# EAGLE schematic stm32uni (EAGLE 6.1)
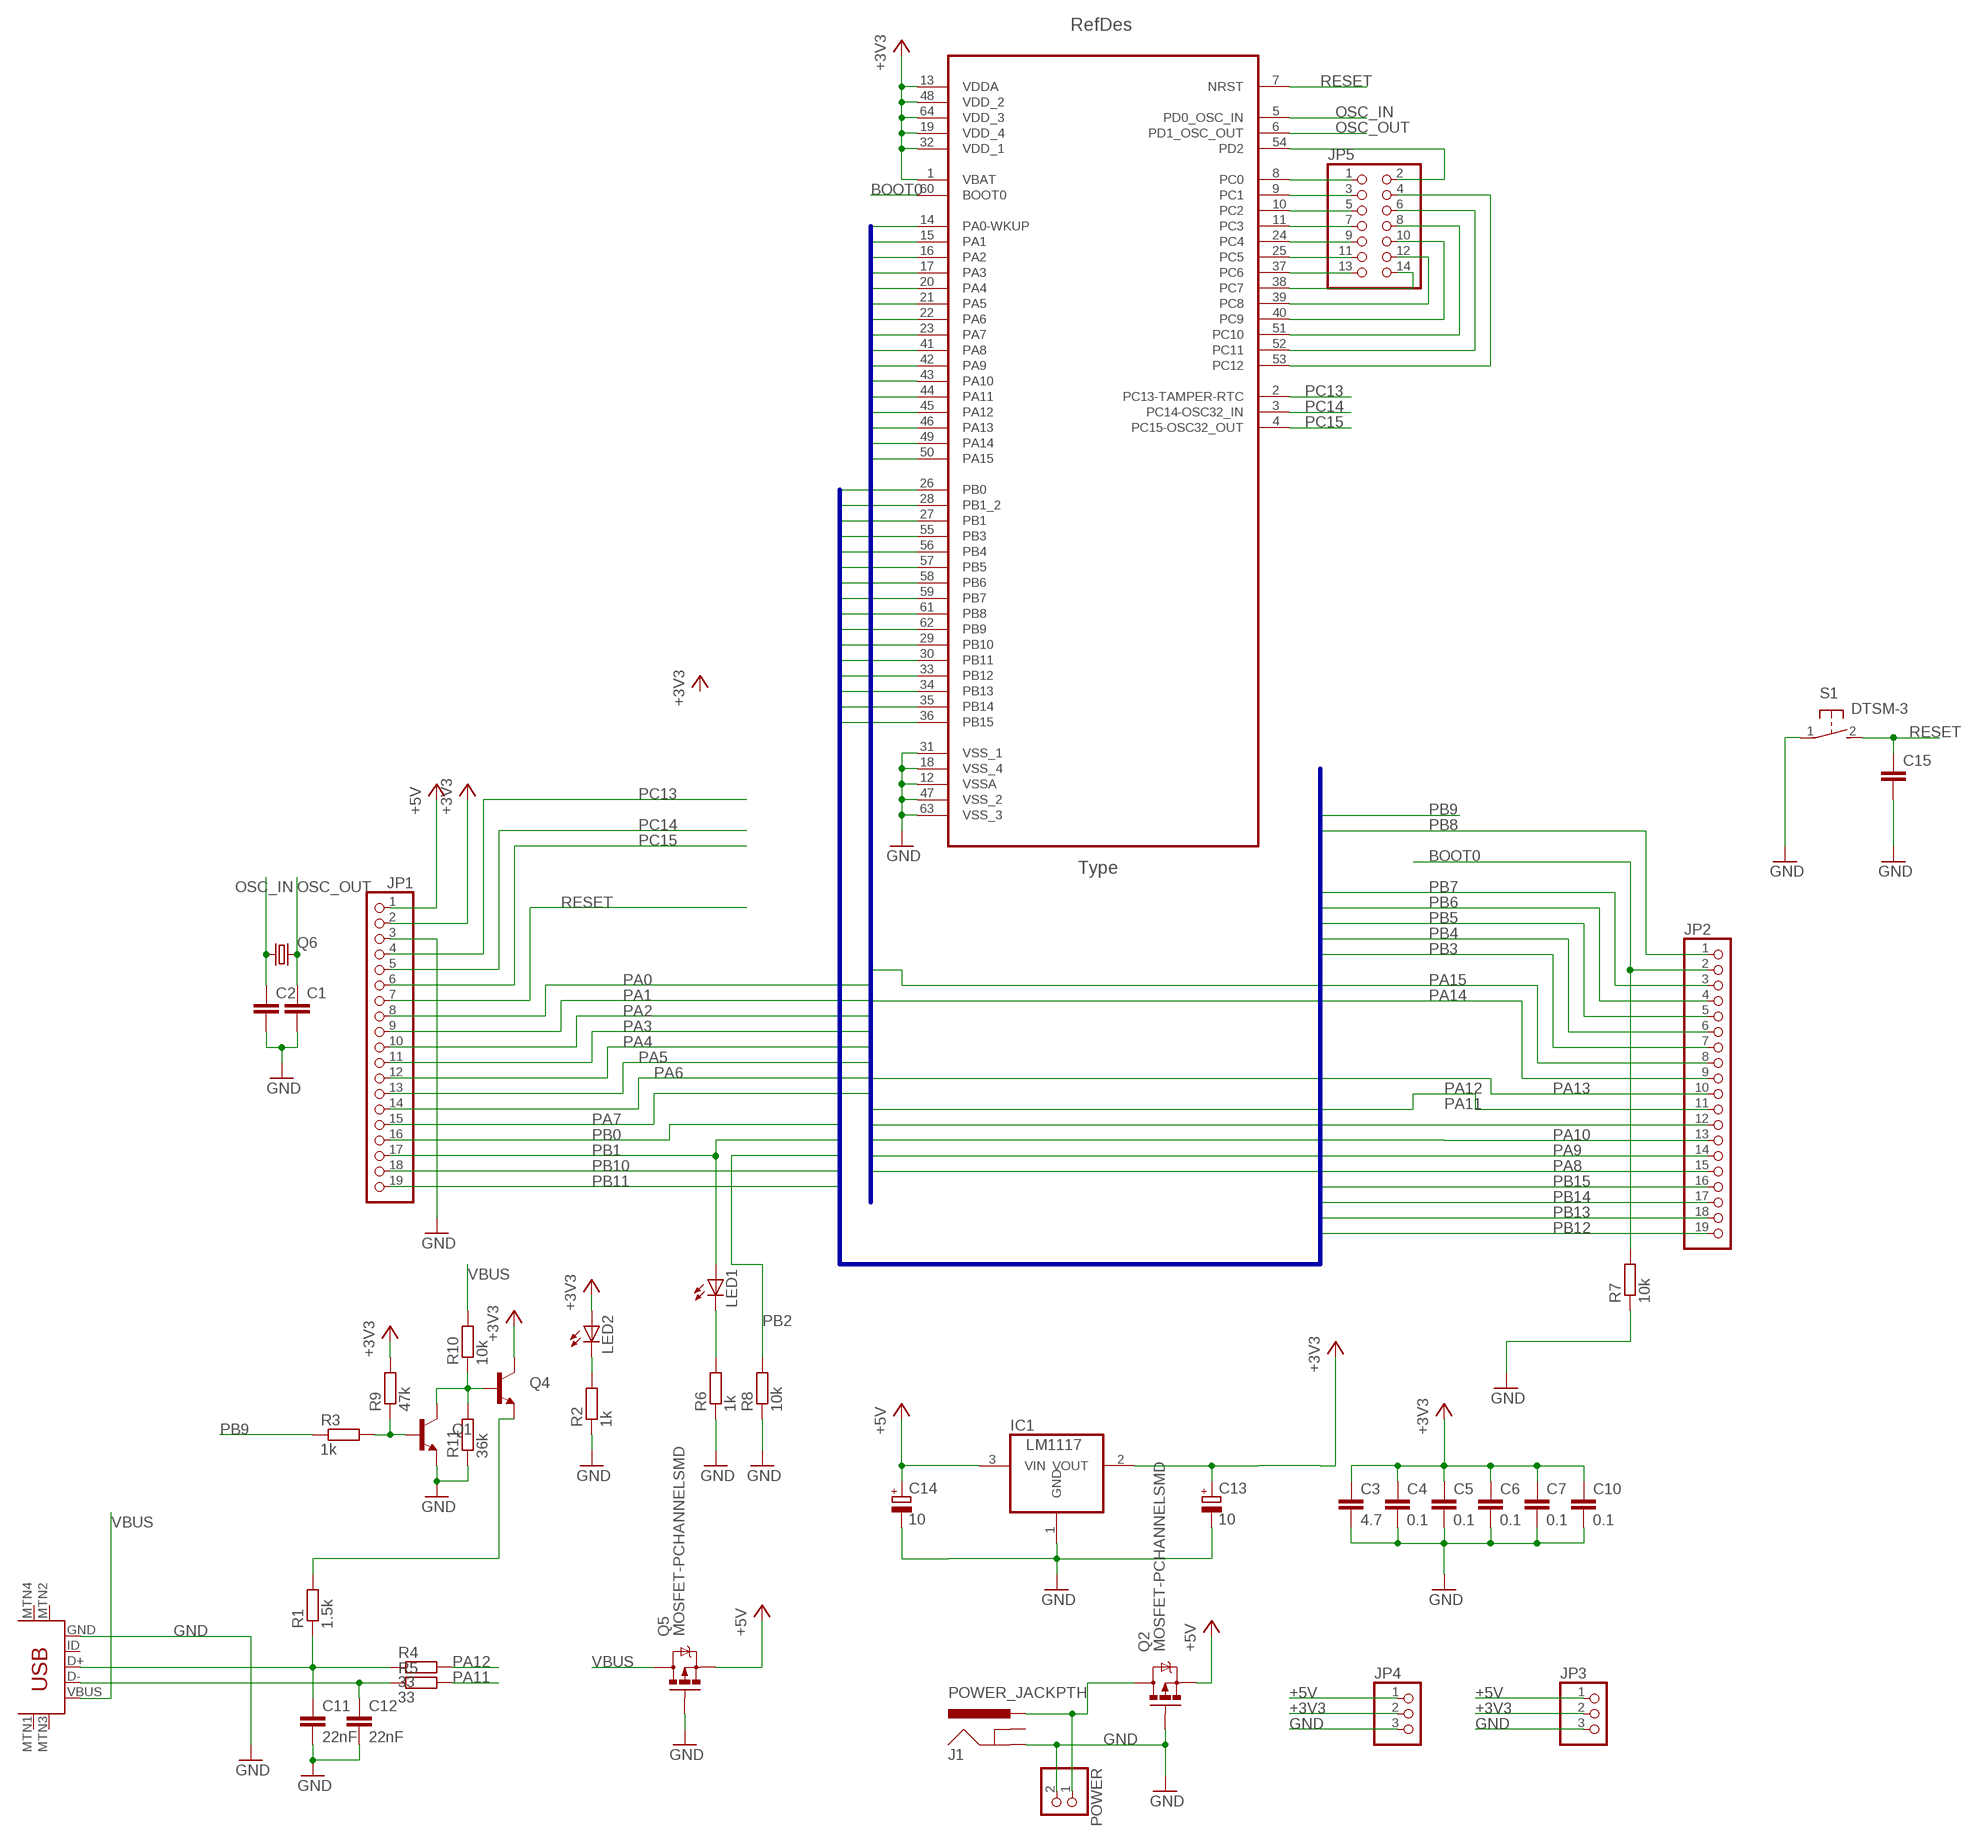
[diagram p0: schematic, sheet 1]

## Parts
C1  C-EUC0805  [C0805]
C2  C-EUC0805  [C0805]
C3  4.7  C-EUC0805  [C0805]
C4  0.1  C-EUC0805  [C0805]
C5  0.1  C-EUC0805  [C0805]
C6  0.1  C-EUC0805  [C0805]
C7  0.1  C-EUC0805  [C0805]
C10  0.1  C-EUC0805  [C0805]
C11  22nF  C-EUC0805  [C0805]
C12  22nF  C-EUC0805  [C0805]
C13  10  CPOL-EUSMCB  [SMC_B]
C14  10  CPOL-EUSMCB  [SMC_B]
C15  C-EUC0805  [C0805]
IC1  LM1117  REG1117  [SOT223]
J1  POWER_JACKPTH  [POWER_JACK_PTH]
JP1  PINHD-1X19  [1X19]
JP2  PINHD-1X19  [1X19]
JP3  PINHD-1X3  [1X03]
JP4  PINHD-1X3  [1X03]
JP5  PINHD-2X7  [2X07]
LED1  LEDCHIPLED_0805  [CHIPLED_0805]
LED2  LEDCHIPLED_0805  [CHIPLED_0805]
POWER  PINHD-1X2  [1X02]
Q1  TRANSISTOR_NPNSOT23  [SOT23]
Q2  MOSFET-PCHANNELSMD  [SOT23-3]
Q4  TRANSISTOR_NPNSOT23  [SOT23]
Q5  MOSFET-PCHANNELSMD  [SOT23-3]
Q6  CRYSTALSM49  [SM49]
R1  1.5k  R-EU_R0805  [R0805]
R2  1k  R-EU_R0805  [R0805]
R3  1k  R-EU_R0805  [R0805]
R4  33  R-EU_R0805  [R0805]
R5  33  R-EU_R0805  [R0805]
R6  1k  R-EU_R0805  [R0805]
R7  10k  R-EU_R0805  [R0805]
R8  10k  R-EU_R0805  [R0805]
R9  47k  R-EU_R0805  [R0805]
R10  10k  R-EU_R0805  [R0805]
R11  36k  R-EU_R0805  [R0805]
S1  DTSM-3  [DTSM-3]
U1  STM32F103RET6  [QFP50P1200X1200X160-64N]
U$1  USB-MINIB-5PIN  [USB-MINIB]

## Nets
+3V3: C3.1 C4.1 C5.1 C6.1 C7.1 C10.1 C13.+ IC1.2(VOUT) JP1.2 JP3.2 JP4.2 LED2.A Q4.3(C) R9.2 U1.1(VBAT) U1.13(VDDA) U1.19(VDD_4) U1.32(VDD_1) U1.48(VDD_2) U1.64(VDD_3)
+5V: C14.+ IC1.3(VIN) JP1.1 JP3.1 JP4.1 Q2.2(S) Q5.2(S)
BOOT0: JP2.2 R7.2 U1.60(BOOT0)
GND: C1.2 C2.2 C3.2 C4.2 C5.2 C6.2 C7.2 C10.2 C11.2 C12.2 C13.- C14.- C15.2 IC1.1(GND) J1.GND JP1.3 JP3.3 JP4.3 POWER.2 Q1.2(E) Q2.1(G) Q5.1(G) R2.1 R6.1 R7.1 R8.1 R11.1 S1.1 U1.12(VSSA) U1.18(VSS_4) U1.31(VSS_1) U1.47(VSS_2) U1.63(VSS_3) U$1.GND
N$1: LED2.C R2.2
N$2: J1.PWR POWER.1 Q2.3(D)
N$4: Q1.1(B) R3.2 R9.1
N$5: Q1.3(C) Q4.1(B) R10.1 R11.2
N$6: C11.1 R1.1 R4.1 U$1.D+
N$7: C12.1 R5.1 U$1.D-
N$8: JP5.1 U1.8(PC0)
N$9: Q4.2(E) R1.2
N$10: JP5.3 U1.9(PC1)
N$11: JP5.5 U1.10(PC2)
N$12: JP5.7 U1.11(PC3)
N$13: JP5.9 U1.24(PC4)
N$14: JP5.11 U1.25(PC5)
N$15: JP5.13 U1.37(PC6)
N$16: JP5.14 U1.38(PC7)
N$17: JP5.12 U1.39(PC8)
N$18: JP5.10 U1.40(PC9)
N$19: JP5.8 U1.51(PC10)
N$20: JP5.6 U1.52(PC11)
N$21: JP5.4 U1.53(PC12)
N$22: JP5.2 U1.54(PD2)
N$42: LED1.C R6.2
OSC_IN: C2.1 Q6.1 U1.5(PD0_OSC_IN)
OSC_OUT: C1.1 Q6.2 U1.6(PD1_OSC_OUT)
PA0: JP1.8 U1.14(PA0-WKUP)
PA1: JP1.9 U1.15(PA1)
PA2: JP1.10 U1.16(PA2)
PA3: JP1.11 U1.17(PA3)
PA4: JP1.12 U1.20(PA4)
PA5: JP1.13 U1.21(PA5)
PA6: JP1.14 U1.22(PA6)
PA7: JP1.15 U1.23(PA7)
PA8: JP2.15 U1.41(PA8)
PA9: JP2.14 U1.42(PA9)
PA10: JP2.13 U1.43(PA10)
PA11: JP2.12 R5.2 U1.44(PA11)
PA12: JP2.11 R4.2 U1.45(PA12)
PA13: JP2.10 U1.46(PA13)
PA14: JP2.9 U1.49(PA14)
PA15: JP2.8 U1.50(PA15)
PB0: JP1.16 U1.26(PB0)
PB1: JP1.17 LED1.A U1.27(PB1)
PB2: R8.2 U1.28(PB1_2)
PB3: JP2.7 U1.55(PB3)
PB4: JP2.6 U1.56(PB4)
PB5: JP2.5 U1.57(PB5)
PB6: JP2.4 U1.58(PB6)
PB7: JP2.3 U1.59(PB7)
PB8: JP2.1 U1.61(PB8)
PB9: R3.1 U1.62(PB9)
PB10: JP1.18 U1.29(PB10)
PB11: JP1.19 U1.30(PB11)
PB12: JP2.19 U1.33(PB12)
PB13: JP2.18 U1.34(PB13)
PB14: JP2.17 U1.35(PB14)
PB15: JP2.16 U1.36(PB15)
PC13: JP1.4 U1.2(PC13-TAMPER-RTC)
PC14: JP1.5 U1.3(PC14-OSC32_IN)
PC15: JP1.6 U1.4(PC15-OSC32_OUT)
RESET: C15.1 JP1.7 S1.2 U1.7(NRST)
VBUS: Q5.3(D) R10.2 U$1.VBUS
Unconnected: J1.GNDBREAK U$1.ID U$1.MTN1(MTN2) U$1.MTN2(MTN3) U$1.MTN3(MTN1) U$1.MTN4

## Buses
PA[0..15]
PB[0..15]

## Library data of the parts
C1-C7 C10-C12 C15 = rcl:C-EU: CAPACITOR, European symbol
C13 C14 = rcl:CPOL-EU: POLARIZED CAPACITOR, European symbol
IC1 = burr-brown:REG1117: 800mA and 1A Low Dropout (LDO) Positive Regulator 1.8V, 2.5V, 2.85V, 3.3V, 5V, and Adj; MPN: REG1117; OC_FARNELL: 1097566; OC_NEWARK: 14P6981
J1 = SparkFun:POWER_JACK: Power Jack This is the standard 5.5mm barrel jack for power. The PTH is the most common, proven, reliable, footprint. All others are experimental. The Slot footprint only works if the mill layer is transmitted to the PCB fab house so be warned. Spark Fun Electronics SKU : PRT-00119. Mating wall wart : TOL-00298 (and others)
JP1 JP2 = pinhead:PINHD-1X19: PIN HEADER
JP3 JP4 = pinhead:PINHD-1X3: PIN HEADER
JP5 = pinhead:PINHD-2X7: PIN HEADER
LED1 LED2 = led:LED: LED OSRAM: - CHIPLED LG R971, LG N971, LY N971, LG Q971, LY Q971, LO R971, LY R971 LH N974, LH R974 LS Q976, LO Q976, LY Q976 LO Q996 - Hyper CHIPLED LW Q18S LB Q993, LB Q99A, LB R99A - SideLED LS A670, LO A670, LY A670, LG A670, LP A670 LB A673, LV A673, LT A673, LW A673 LH A674 LY A675 LS A676, LA A676, LO A676, LY A676, LW A676 LS A679, LY A679, LG A679 - Hyper Micro SIDELED® LS Y876, LA Y876, LO Y876, LY Y876 LT Y87S - SmartLED LW L88C, LW L88S LB L89C, LB L89S, LG L890 LS L89K, LO L89K, LY L89K LS L896, LA L896, LO L896, LY L896 - TOPLED LS T670, LO T670, LY T670, LG T670, LP T670 LSG T670, LSP T670, LSY T670, LOP T670, LYG T670 LG T671, LOG T671, LSG T671 LB T673, LV T673, LT T673, LW T673 LH T674 LS T676, LA T676, LO T676, LY T676, LB T676, LH T676, LSB T676, LW T676 LB T67C, LV T67C, LT T67C, LS T67K, LO T67K, LY T67K, LW E67C LS E67B, LA E67B, LO E67B, LY E67B, LB E67C, LV E67C, LT E67C LW T67C LS T679, LY T679, LG T679 LS T770, LO T770, LY T770, LG T770, LP T770 LB T773, LV T773, LT T773, LW T773 LH T774 LS E675, LA E675, LY E675, LS T675 LS T776, LA T776, LO T776, LY T776, LB T776 LHGB T686 LT T68C, LB T68C - Hyper Mini TOPLED® LB M676 - Mini TOPLED Santana® LG M470 LS M47K, LO M47K, LY M47K Source: http://www.osram.convergy.de LUXEON: - LUMILED® LXK2-PW12-R00, LXK2-PW12-S00, LXK2-PW14-U00, LXK2-PW14-V00 LXK2-PM12-R00, LXK2-PM12-S00, LXK2-PM14-U00 LXK2-PE12-Q00, LXK2-PE12-R00, LXK2-PE12-S00, LXK2-PE14-T00, LXK2-PE14-U00 LXK2-PB12-K00, LXK2-PB12-L00, LXK2-PB12-M00, LXK2-PB14-N00, LXK2-PB14-P00, LXK2-PB14-Q00 LXK2-PR12-L00, LXK2-PR12-M00, LXK2-PR14-Q00, LXK2-PR14-R00 LXK2-PD12-Q00, LXK2-PD12-R00, LXK2-PD12-S00 LXK2-PH12-R00, LXK2-PH12-S00 LXK2-PL12-P00, LXK2-PL12-Q00, LXK2-PL12-R00 Source: www.luxeon.com KINGBRIGHT: KA-3528ASYC Source: www.kingbright.com
POWER = pinhead:PINHD-1X2: PIN HEADER
Q1 Q4 = SparkFun:TRANSISTOR_NPN: Transistor NPN BJT configuration in SOT23 package. MMBT2222 is the common NPN we use. Double check BCE configuration again layout.
Q2 Q5 = SparkFun:MOSFET-PCHANNEL
Q6 = crystal:CRYSTAL: CRYSTAL; OC_FARNELL: unknown; OC_NEWARK: unknown
R1-R11 = rcl:R-EU_: RESISTOR, European symbol
S1 = switch-tact:DTSM-3
U1 = stm32f103ret6:STM32F103RET6: ARM-based 32-bit MCU; DESCRIPTION: ARM-based 32-bit MCU; MPN: STM32F103RET6; OC_FARNELL: 1624138; OC_NEWARK: 01P4101; PACKAGE: QFP-64; SUPPLIER: STMICROELECTRONICS
U$1 = SparkFun:USB-MINIB: Mini-USB "B" connector with 5th pin broken out. Created new symbol breaking out 5th "ID" pin in mini/micro USB connector spec. See: http://en.wikipedia.org/wiki/Mini_usb#Cables. Uses same footprint as 4-pin symbol. Also added pins to connect to mounting / shield pads if required (probably not generally needed as signals aren't shielded once they leave the connector).